# EAGLE design x21_jumper (EAGLE 7.7.0)
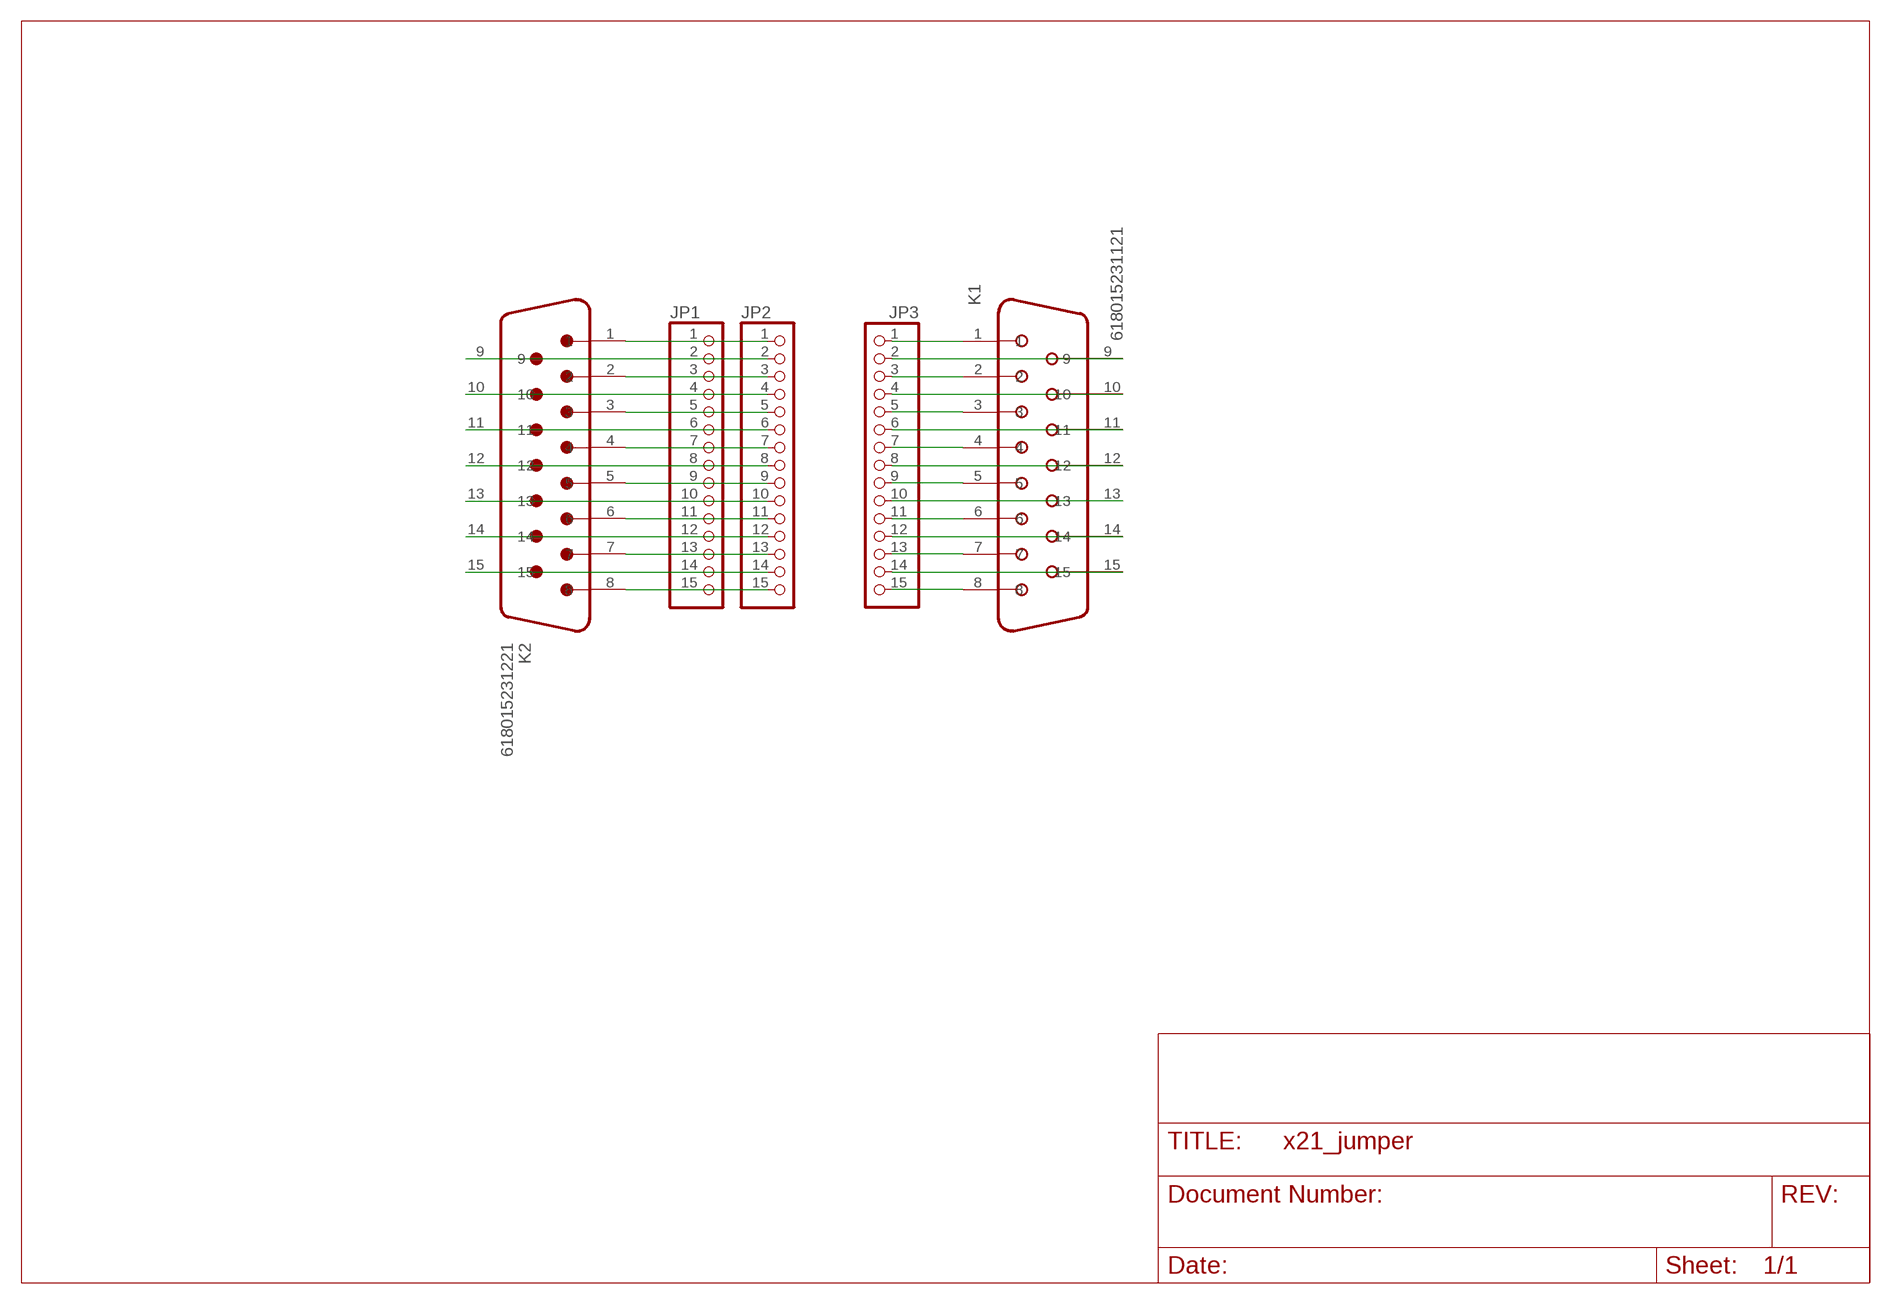
[diagram p0: schematic, sheet 1]

## Parts
JP1  PINHD-1X15  [1X15]
JP2  PINHD-1X15  [1X15]
JP3  PINHD-1X15  [1X15]
K1  618015231121  [618015231121]
K2  618015231221  [618015231221]

## Nets
B_A_1: JP3.13 K1.7
B_A_2: JP1.13 JP2.13 K2.7
B_B_1: JP3.12 K1.14
B_B_2: JP1.12 JP2.12 K2.14
C_A_1: JP3.5 K1.3
C_A_2: JP1.5 JP2.5 K2.3
C_B_1: JP3.4 K1.10
C_B_2: JP1.4 JP2.4 K2.10
GND_1: JP3.15 K1.8
GND_2: JP1.15 JP2.15 K2.8
I_A_1: JP3.9 K1.5
I_A_2: JP1.9 JP2.9 K2.5
I_B_1: JP3.8 K1.12
I_B_2: JP1.8 JP2.8 K2.12
N$14: JP1.14 JP2.14 K2.15
N$29: JP3.14 K1.15
R_A_1: JP3.7 K1.4
R_A_2: JP1.7 JP2.7 K2.4
R_B_1: JP3.6 K1.11
R_B_2: JP1.6 JP2.6 K2.11
S_A_1: JP3.11 K1.6
S_A_2: JP1.11 JP2.11 K2.6
S_B_1: JP3.10 K1.13
S_B_2: JP1.10 JP2.10 K2.13
SHLD_1: JP3.1 K1.1
SHLD_2: JP1.1 JP2.1 K2.1
T_A_1: JP3.3 K1.2
T_A_2: JP1.3 JP2.3 K2.2
T_B_1: JP3.2 K1.9
T_B_2: JP1.2 JP2.2 K2.9

## Library data of the parts
JP1-JP3 = pinhead:PINHD-1X15: PIN HEADER
K1 = Wuerth_Elektronik_eiCan_Communication_Connectors_v6_20150113:618015231121: WR-DSUB 8.08mm Female Angled PCB Connector with Hex Screw, 15 Pins=>Code : Con_I-O_DSUB_PCB_Female_w-screw_618015231121 <http://katalog.we-online.de/media/images/eican/Con_I-O_DSUB_PCB_Female_w-screw_6180xx231121_pf2.jpg> Details see: http://katalog.we-online.de/en/em/618_0xx_231_121 Created 2014-07-10, Karrer Zheng 2014 (C) Würth Elektronik
K2 = Wuerth_Elektronik_eiCan_Communication_Connectors_v6_20150113:618015231221: WR-DSUB 8.08mm Male Angled PCB Connector with Hex Screw, 15 Pins=>Code : Con_I-O_DSUB_PCB_Male_w-screw_618015231221 <http://katalog.we-online.de/media/images/eican/Con_I-O_DSUB_PCB_Male_w-screw_6180xx231221_pf2.jpg> Details see: http://katalog.we-online.de/en/em/618_0xx_231_221 Created 2014-07-10, Karrer Zheng 2014 (C) Würth Elektronik

## Board
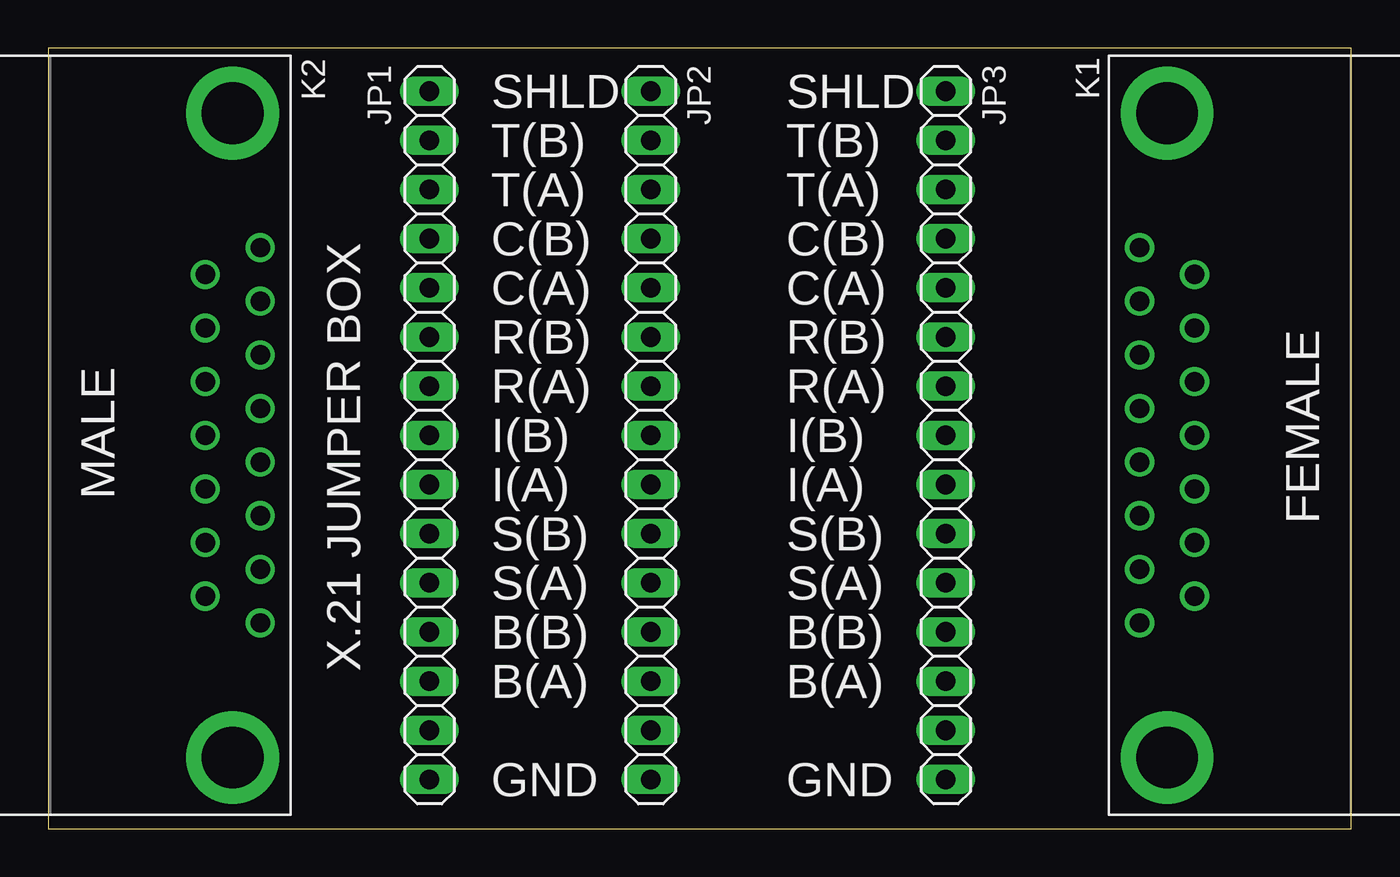
[diagram p1: board, top side]
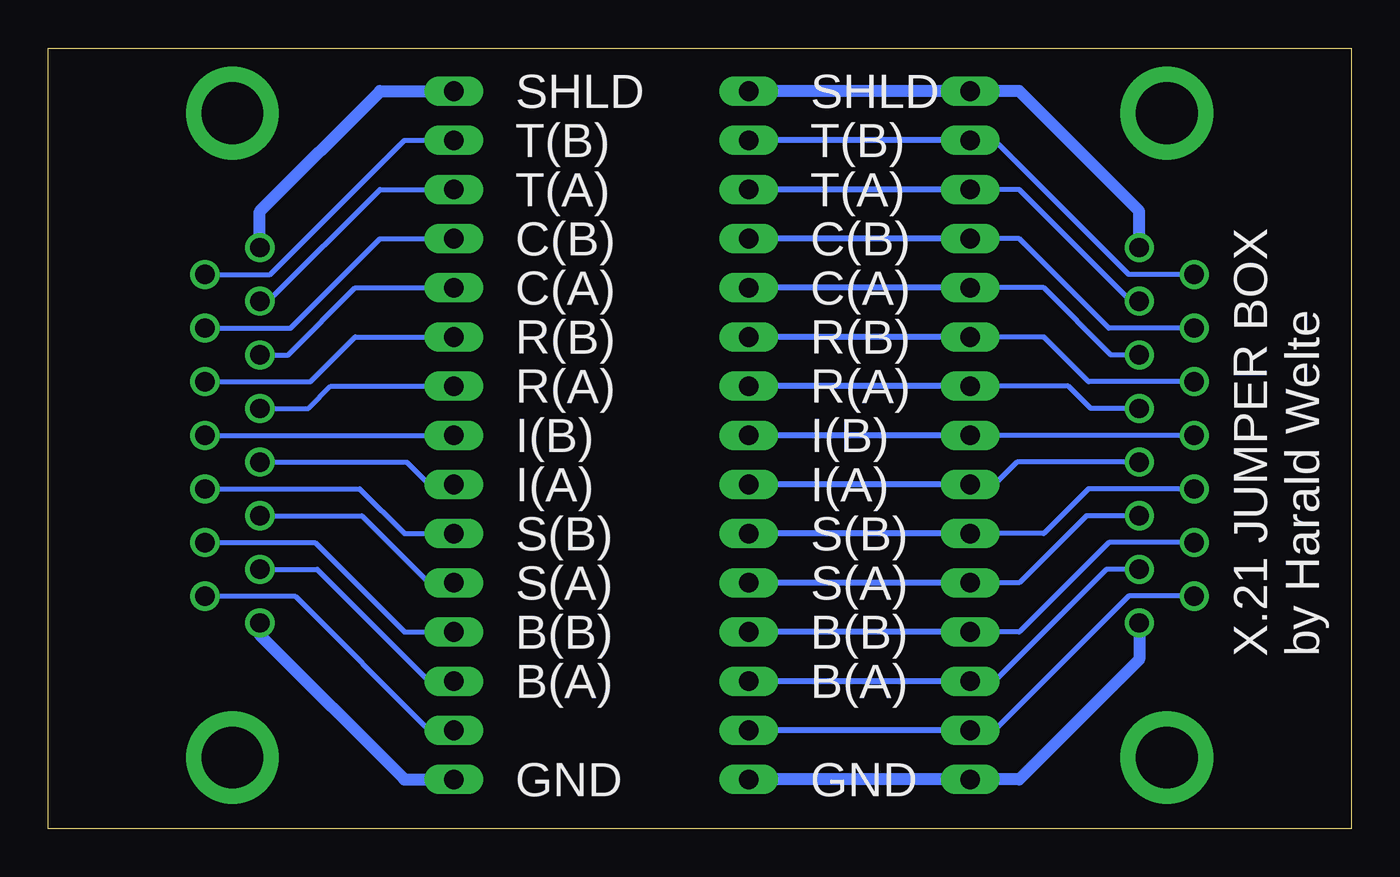
[diagram p2: board, bottom side, seen from below]

Size 67.29 x 40.31 mm. Coordinates in mm from the lower left corner, seen from the top.
Outline: 0,0 67.29,0 67.29,40.31 0,40.31 0,0
Copper layers (1*16): Top 0.035mm / dielectric 1.5mm / Bottom 0.035mm
Design rules "aisler_2_layer_simple *": minimum track width 0.2mm, minimum drill 0.45mm, track to track 0.175mm, track to pad 0.175mm, pad to pad 0.175mm, via to via 0.175mm, smd to smd 0.175mm, copper to edge 0.3mm, drill to drill 0.25mm, minimum pad ring 0.2mm, minimum via ring 0.2mm, stop-mask expansion 0mil, vias tented up to drill 0mil, thermal gap 10mil

### Footprints (pad centres in the part's own frame; a part is rotated, then mirrored left to right if it is on the bottom)
1X15 = drill 1.016 long: 1 -17.78,0; 2 -15.24,0; 3 -12.7,0; 4 -10.16,0; 5 -7.62,0; 6 -5.08,0; 7 -2.54,0; 8 0,0; 9 2.54,0; 10 5.08,0; 11 7.62,0; 12 10.16,0; 13 12.7,0; 14 15.24,0; 15 17.78,0
618015231121 = drill 1: 1 9.695,1.42; 2 6.925,1.42; 3 4.155,1.42; 4 1.385,1.42; 5 -1.385,1.42; 6 -4.155,1.42; 7 -6.925,1.42; 8 -9.695,1.42; 9 8.31,-1.42; 10 5.54,-1.42; 11 2.77,-1.42; 12 0,-1.42; 13 -2.77,-1.42; 14 -5.54,-1.42; 15 -8.31,-1.42 | drill 3.2: Z1 -16.65,0; Z2 16.65,0
618015231221 = drill 1: 1 -9.695,1.42; 2 -6.925,1.42; 3 -4.155,1.42; 4 -1.385,1.42; 5 1.385,1.42; 6 4.155,1.42; 7 6.925,1.42; 8 9.695,1.42; 9 -8.31,-1.42; 10 -5.54,-1.42; 11 -2.77,-1.42; 12 0,-1.42; 13 2.77,-1.42; 14 5.54,-1.42; 15 8.31,-1.42 | drill 3.2: Z1 -16.65,0; Z2 16.65,0

### Placement (x,y rotation side)
JP1  19.68,20.32 270 top
JP2  31.11,20.32 270 top
JP3  46.35,20.32 270 top
K1  57.78,20.32 90 top
K2  9.53,20.32 270 top

### Tracks (layer width: path | path; a pad name or v marks a point on that pad's centre or on a via)
B_A_1
  Bottom 0.254: K1.7 53.4,13.39 47.62,7.62 JP3.13
B_A_2
  Bottom 0.254: K2.7 12.64,13.39 18.41,7.62 JP1.13
  Bottom 0.305: JP1.13 JP2.13
B_B_1
  Bottom 0.254: K1.14 53.52,14.78 48.9,10.16 JP3.12
B_B_2
  Bottom 0.254: K2.14 12.53,14.78 17.14,10.16 JP1.12 20.95,10.16
  Bottom 0.305: JP1.12 JP2.12
C_A_1
  Bottom 0.254: K1.3 54.9,24.48 51.44,27.94 JP3.5
C_A_2
  Bottom 0.254: K2.3 12.41,24.48 15.88,27.94 JP1.5
  Bottom 0.305: JP1.5 JP2.5
C_B_1
  Bottom 0.254: K1.10 54.78,25.86 50.16,30.48 JP3.4
C_B_2
  Bottom 0.254: K2.10 12.53,25.86 17.14,30.48 JP1.4 | 29.84,30.48 JP2.4
  Bottom 0.305: JP1.4 JP2.4
GND_1
  Bottom 0.61: K1.8 56.37,10.01 48.9,2.54 JP3.15
GND_2
  Bottom 0.61: K2.8 10.95,8.74 17.14,2.54 JP1.15 JP2.15
I_A_1
  Bottom 0.254: K1.5 48.78,18.93 47.62,17.78 JP3.9
I_A_2
  Bottom 0.254: K2.5 17.26,18.93 18.41,17.78 JP1.9
  Bottom 0.305: JP1.9 JP2.9
I_B_1
  Bottom 0.254: K1.12 JP3.8
I_B_2
  Bottom 0.254: K2.12 JP1.8
  Bottom 0.305: JP1.8 JP2.8
N$14
  Bottom 0.254: K2.15 11.48,12.01 18.41,5.08 JP1.14
  Bottom 0.305: JP1.14 JP2.14
N$29
  Bottom 0.254: K1.15 54.55,12.01 47.62,5.08 JP3.14
R_A_1
  Bottom 0.254: K1.4 53.86,21.7 52.7,22.86 JP3.7
R_A_2
  Bottom 0.254: K2.4 13.45,21.7 14.61,22.86 JP1.7
  Bottom 0.305: JP1.7 JP2.7
R_B_1
  Bottom 0.254: K1.11 53.74,23.09 51.44,25.4 JP3.6
R_B_2
  Bottom 0.254: K2.11 13.56,23.09 15.88,25.4 JP1.6
  Bottom 0.305: JP1.6 JP2.6
S_A_1
  Bottom 0.254: K1.6 51.09,16.16 47.62,12.7 JP3.11
S_A_2
  Bottom 0.254: K2.6 13.68,16.16 17.14,12.7 JP1.11
  Bottom 0.305: JP1.11 JP2.11
S_B_1
  Bottom 0.254: K1.13 51.2,17.55 48.9,15.24 JP3.10
S_B_2
  Bottom 0.254: K2.13 13.56,17.55 15.88,15.24 JP1.10
  Bottom 0.305: JP1.10 JP2.10
SHLD_1
  Bottom 0.61: K1.1 56.37,31.9 50.16,38.1 JP3.1
SHLD_2
  Bottom 0.61: K2.1 10.95,31.9 17.14,38.1 JP1.1 JP2.1
T_A_1
  Bottom 0.254: K1.2 55.94,27.25 50.16,33.02 JP3.3
T_A_2
  Bottom 0.254: K2.2 11.37,27.25 17.14,33.02 JP1.3
  Bottom 0.305: JP1.3 JP2.3
T_B_1
  Bottom 0.254: K1.9 55.83,28.63 48.9,35.56 JP3.2
T_B_2
  Bottom 0.254: K2.9 11.48,28.63 18.41,35.56 JP1.2
  Bottom 0.305: JP1.2 JP2.2

### Text on the board
tNames: SHLD | SHLD | T(B) | T(B) | T(A) | T(A) | C(B) | C(B) | C(A) | C(A) | R(B) | R(B) | R(A) | R(A) | I(B) | I(B) | MALE | I(A) | I(A) | FEMALE | S(B) | S(B) | S(A) | S(A) | B(B) | B(B) | X.21 JUMPER BOX | B(A) | B(A) | GND | GND
bNames: SHLD | SHLD | T(B) | T(B) | T(A) | T(A) | C(B) | C(B) | C(A) | C(A) | R(B) | R(B) | R(A) | R(A) | I(B) | I(B) | I(A) | I(A) | S(B) | S(B) | S(A) | S(A) | X.21 JUMPER BOX / by Harald Welte | B(B) | B(B) | B(A) | B(A) | GND | GND